# EAGLE schematic mkf434_ME433_HW2Schematic (EAGLE 8.1.0)
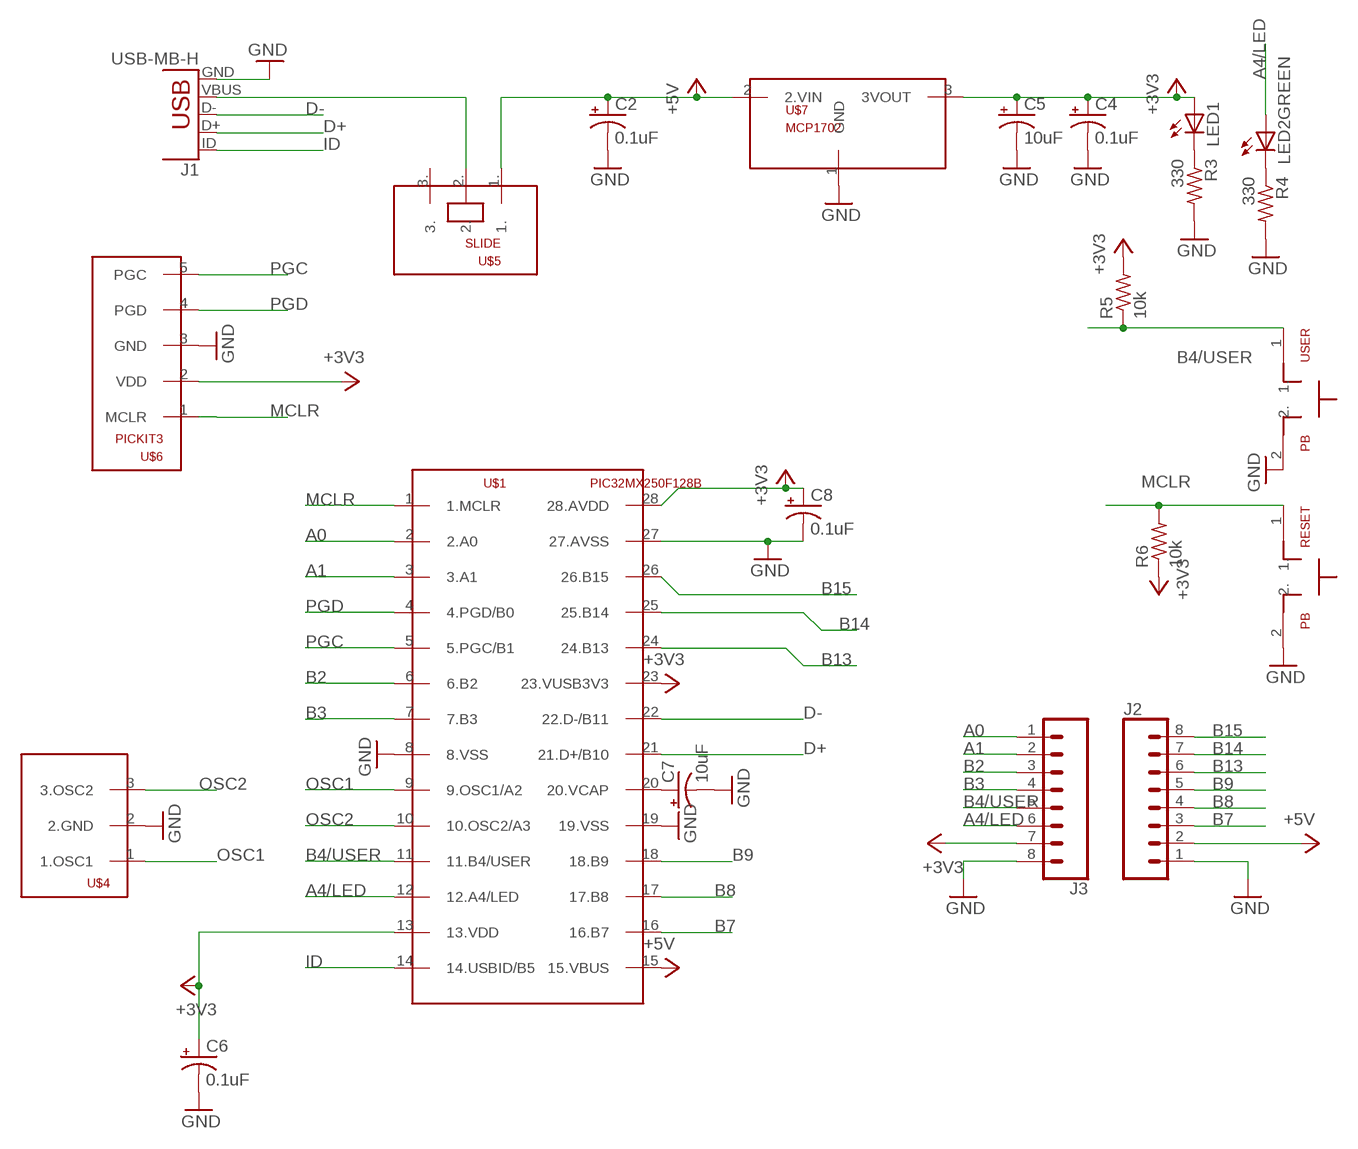
[diagram p0: schematic, sheet 1]

## Parts
C2  0.1uF  CPOL-USB45181B  [B45181B]
C4  0.1uF  CPOL-USB45181B  [B45181B]
C5  10uF  CPOL-USB45181B  [B45181B]
C6  0.1uF  CPOL-USB45181B  [B45181B]
C7  10uF  CPOL-USB45181B  [B45181B]
C8  0.1uF  CPOL-USB45181B  [B45181B]
J1  USB-MB-H  [USB-MB-H]
J2  CONN_08"  [1X08]
J3  CONN_08"  [1X08]
LED1  LED3MM  [LED3MM]
LED2GREEN  LED3MM  [LED3MM]
R3  330  R-US_0207/10  [0207/10]
R4  330  R-US_0207/10  [0207/10]
R5  10k  R-US_0207/10  [0207/10]
R6  10k  R-US_0207/10  [0207/10]
RESET  PB  [PB]
U$1  PIC32MX250F128B  [DIL28-3]
U$4  OSCO  [OSC]
U$5  SLIDE  [SLIDE]
U$6  PICKIT3  [1X05]
U$7  MCP1702  [TO92]
USER  PB  [PB]

## Nets
+3V3: R5.2 R6.1 U$1.23(23.VUSB3V3)
+5V: U$1.15(15.VBUS)
A0: J3.1 U$1.2(2.A0)
A1: J3.2 U$1.3(3.A1)
A4/LED: J3.6 LED2GREEN.A U$1.12(12.A4/LED)
B2: J3.3 U$1.6(6.B2)
B3: J3.4 U$1.7(7.B3)
B4/USER: J3.5 R5.1 U$1.11(11.B4/USER) USER.1(1.)
B7: J2.3 U$1.16(16.B7)
B8: J2.4 U$1.17(17.B8)
B9: J2.5 U$1.18(18.B9)
B13: J2.6 U$1.24(24.B13)
B14: J2.7 U$1.25(25.B14)
B15: J2.8 U$1.26(26.B15)
D+: J1.D+ U$1.21(21.D+/B10)
D-: J1.D- U$1.22(22.D-/B11)
GND: C2.- C4.- C5.- C6.- C7.- J1.GND R3.2 R4.2 RESET.2(2.) U$1.8(8.VSS) U$1.19(19.VSS) U$4.2(2.GND) U$6.3(GND) U$7.1(GND) USER.2(2.)
ID: J1.ID U$1.14(14.USBID/B5)
MCLR: R6.2 RESET.1(1.) U$1.1(1.MCLR) U$6.1(MCLR)
N$1: J1.VBUS U$5.2.
N$2: C2.+ U$5.1. U$7.2(2.VIN) ; supply symbol labelled +5V
N$3: C4.+ C5.+ LED1.A U$7.3(3VOUT) ; supply symbol labelled +3V3
N$4: LED1.K(C) R3.1
N$5: LED2GREEN.K(C) R4.1
N$6: J2.1 ; supply symbol labelled GND
N$7: J2.2 ; supply symbol labelled +5V
N$10: U$6.2(VDD) ; supply symbol labelled +3V3
N$11: C6.+ U$1.13(13.VDD) ; supply symbol labelled +3V3
N$12: C7.+ U$1.20(20.VCAP)
N$13: C8.+ U$1.28(28.AVDD) ; supply symbol labelled +3V3
N$14: J3.7 ; supply symbol labelled +3V3
N$15: J3.8 ; supply symbol labelled GND
N$16: C8.- U$1.27(27.AVSS) ; supply symbol labelled GND
OSC1: U$1.9(9.OSC1/A2) U$4.1(1.OSC1)
OSC2: U$1.10(10.OSC2/A3) U$4.3(3.OSC2)
PGC: U$1.5(5.PGC/B1) U$6.5(PGC)
PGD: U$1.4(4.PGD/B0) U$6.4(PGD)
Unconnected: U$5.3.

## Library data of the parts
C2 C4-C8 = HW2_LIB:CPOL-US: POLARIZED CAPACITOR, American symbol
J1 = HW2_LIB:USB: USB Connectors USB-B-PTH is fully proven SKU : PRT-00139/CONN-08278 USB-miniB is fully proven SKU : PRT-00587 USB-A-PCB is untested. USB-A-H is throughly reviewed, but untested. Spark Fun Electronics SKU : PRT-00437 USB-B-SMT is throughly reviewed, but untested. Needs silkscreen touching up. USB-A-S has not been used/tested USB-MB-H has not been used/tested USB-MICROB has been used. CONN-09505
J2 J3 = HW2_LIB:CONN_08: Multi connection point. Often used as Generic Header-pin footprint for 0.1 inch spaced/style header connections On any of the 0.1 inch spaced packages, you can populate with these: Break Away Headers - Straight <https://www.sparkfun.com/products/116> (PRT-00116) Break Away Male Headers - Right Angle <https://www.sparkfun.com/products/553> (PRT-00553) Female Headers <https://www.sparkfun.com/products/115> (PRT-00115) Break Away Headers - Machine Pin <https://www.sparkfun.com/products/117> (PRT-00117) Break Away Female Headers - Swiss Machine Pin <https://www.sparkfun.com/products/743> (PRT-00743) Arduino Stackable Header - 8 Pin <https://www.sparkfun.com/products/9279> (PRT-09279) For SCREWTERMINALS and SPRING TERMINALS visit here: Screw Terimnals on SparkFun.com <https://www.sparkfun.com/search/results?term=Screw+Terminals> (5mm/3.5mm/2.54mm spacing) This device is also useful as a general connection point to wire up your design to another part of your project. Our various solder wires solder well into these plated through hole pads. Hook-Up Wire - Assortment (Stranded, 22 AWG) <https://www.sparkfun.com/products/11375> (PRT-11375) Hook-Up Wire - Assortment (Solid Core, 22 AWG) <https://www.sparkfun.com/products/11367> (PRT-11367) View the entire wire category on our website here <https://www.sparkfun.com/categories/141> Special notes: Molex polarized connector foot print use with SKU : PRT-08231 with associated crimp pins and housings. 1MM SMD Version SKU: PRT-10208 NOTES ON THE VARIANTS LOCK and LOCK_LONGPADS... This footprint was designed to help hold the alignment of a through-hole component (i.e. 6-pin header) while soldering it into place. You may notice that each hole has been shifted either up or down by 0.005 of an inch from it's more standard position (which is a perfectly straight line). This slight alteration caused the pins (the squares in the middle) to touch the edges of the holes. Because they are alternating, it causes a "brace" to hold the component in place. 0.005 has proven to be the perfect amount of "off-center" position when using our standard breakaway headers. Although looks a little odd when you look at the bare footprint, once you have a header in there, the alteration is very hard to notice. Also,if you push a header all the way into place, it is covered up entirely on the bottom side.; PROD_ID: CONN-08438
LED1 LED2GREEN = led:LED: LED OSRAM: - CHIPLED LG R971, LG N971, LY N971, LG Q971, LY Q971, LO R971, LY R971 LH N974, LH R974 LS Q976, LO Q976, LY Q976 LO Q996 - Hyper CHIPLED LW Q18S LB Q993, LB Q99A, LB R99A - SideLED LS A670, LO A670, LY A670, LG A670, LP A670 LB A673, LV A673, LT A673, LW A673 LH A674 LY A675 LS A676, LA A676, LO A676, LY A676, LW A676 LS A679, LY A679, LG A679 - Hyper Micro SIDELED® LS Y876, LA Y876, LO Y876, LY Y876 LT Y87S - SmartLED LW L88C, LW L88S LB L89C, LB L89S, LG L890 LS L89K, LO L89K, LY L89K LS L896, LA L896, LO L896, LY L896 - TOPLED LS T670, LO T670, LY T670, LG T670, LP T670 LSG T670, LSP T670, LSY T670, LOP T670, LYG T670 LG T671, LOG T671, LSG T671 LB T673, LV T673, LT T673, LW T673 LH T674 LS T676, LA T676, LO T676, LY T676, LB T676, LH T676, LSB T676, LW T676 LB T67C, LV T67C, LT T67C, LS T67K, LO T67K, LY T67K, LW E67C LS E67B, LA E67B, LO E67B, LY E67B, LB E67C, LV E67C, LT E67C LW T67C LS T679, LY T679, LG T679 LS T770, LO T770, LY T770, LG T770, LP T770 LB T773, LV T773, LT T773, LW T773 LH T774 LS E675, LA E675, LY E675, LS T675 LS T776, LA T776, LO T776, LY T776, LB T776 LHGB T686 LT T68C, LB T68C - Hyper Mini TOPLED® LB M676 - Mini TOPLED Santana® LG M470 LS M47K, LO M47K, LY M47K Source: http://www.osram.convergy.de LUXEON: - LUMILED® LXK2-PW12-R00, LXK2-PW12-S00, LXK2-PW14-U00, LXK2-PW14-V00 LXK2-PM12-R00, LXK2-PM12-S00, LXK2-PM14-U00 LXK2-PE12-Q00, LXK2-PE12-R00, LXK2-PE12-S00, LXK2-PE14-T00, LXK2-PE14-U00 LXK2-PB12-K00, LXK2-PB12-L00, LXK2-PB12-M00, LXK2-PB14-N00, LXK2-PB14-P00, LXK2-PB14-Q00 LXK2-PR12-L00, LXK2-PR12-M00, LXK2-PR14-Q00, LXK2-PR14-R00 LXK2-PD12-Q00, LXK2-PD12-R00, LXK2-PD12-S00 LXK2-PH12-R00, LXK2-PH12-S00 LXK2-PL12-P00, LXK2-PL12-Q00, LXK2-PL12-R00 Source: www.luxeon.com KINGBRIGHT: KA-3528ASYC Source: www.kingbright.com
R3-R6 = HW2_LIB:R-US_: RESISTOR, American symbol
RESET USER = HW2_LIB:PB
U$1 = HW2_LIB:PIC32MX250F128B
U$4 = HW2_LIB:OSC
U$5 = HW2_LIB:SLIDE
U$6 = HW2_LIB:PICKIT3
U$7 = HW2_LIB:MCP1702